# EAGLE schematic miniBCS-4_J005904M (EAGLE 7.7.0)

## Sheet 1 of 2
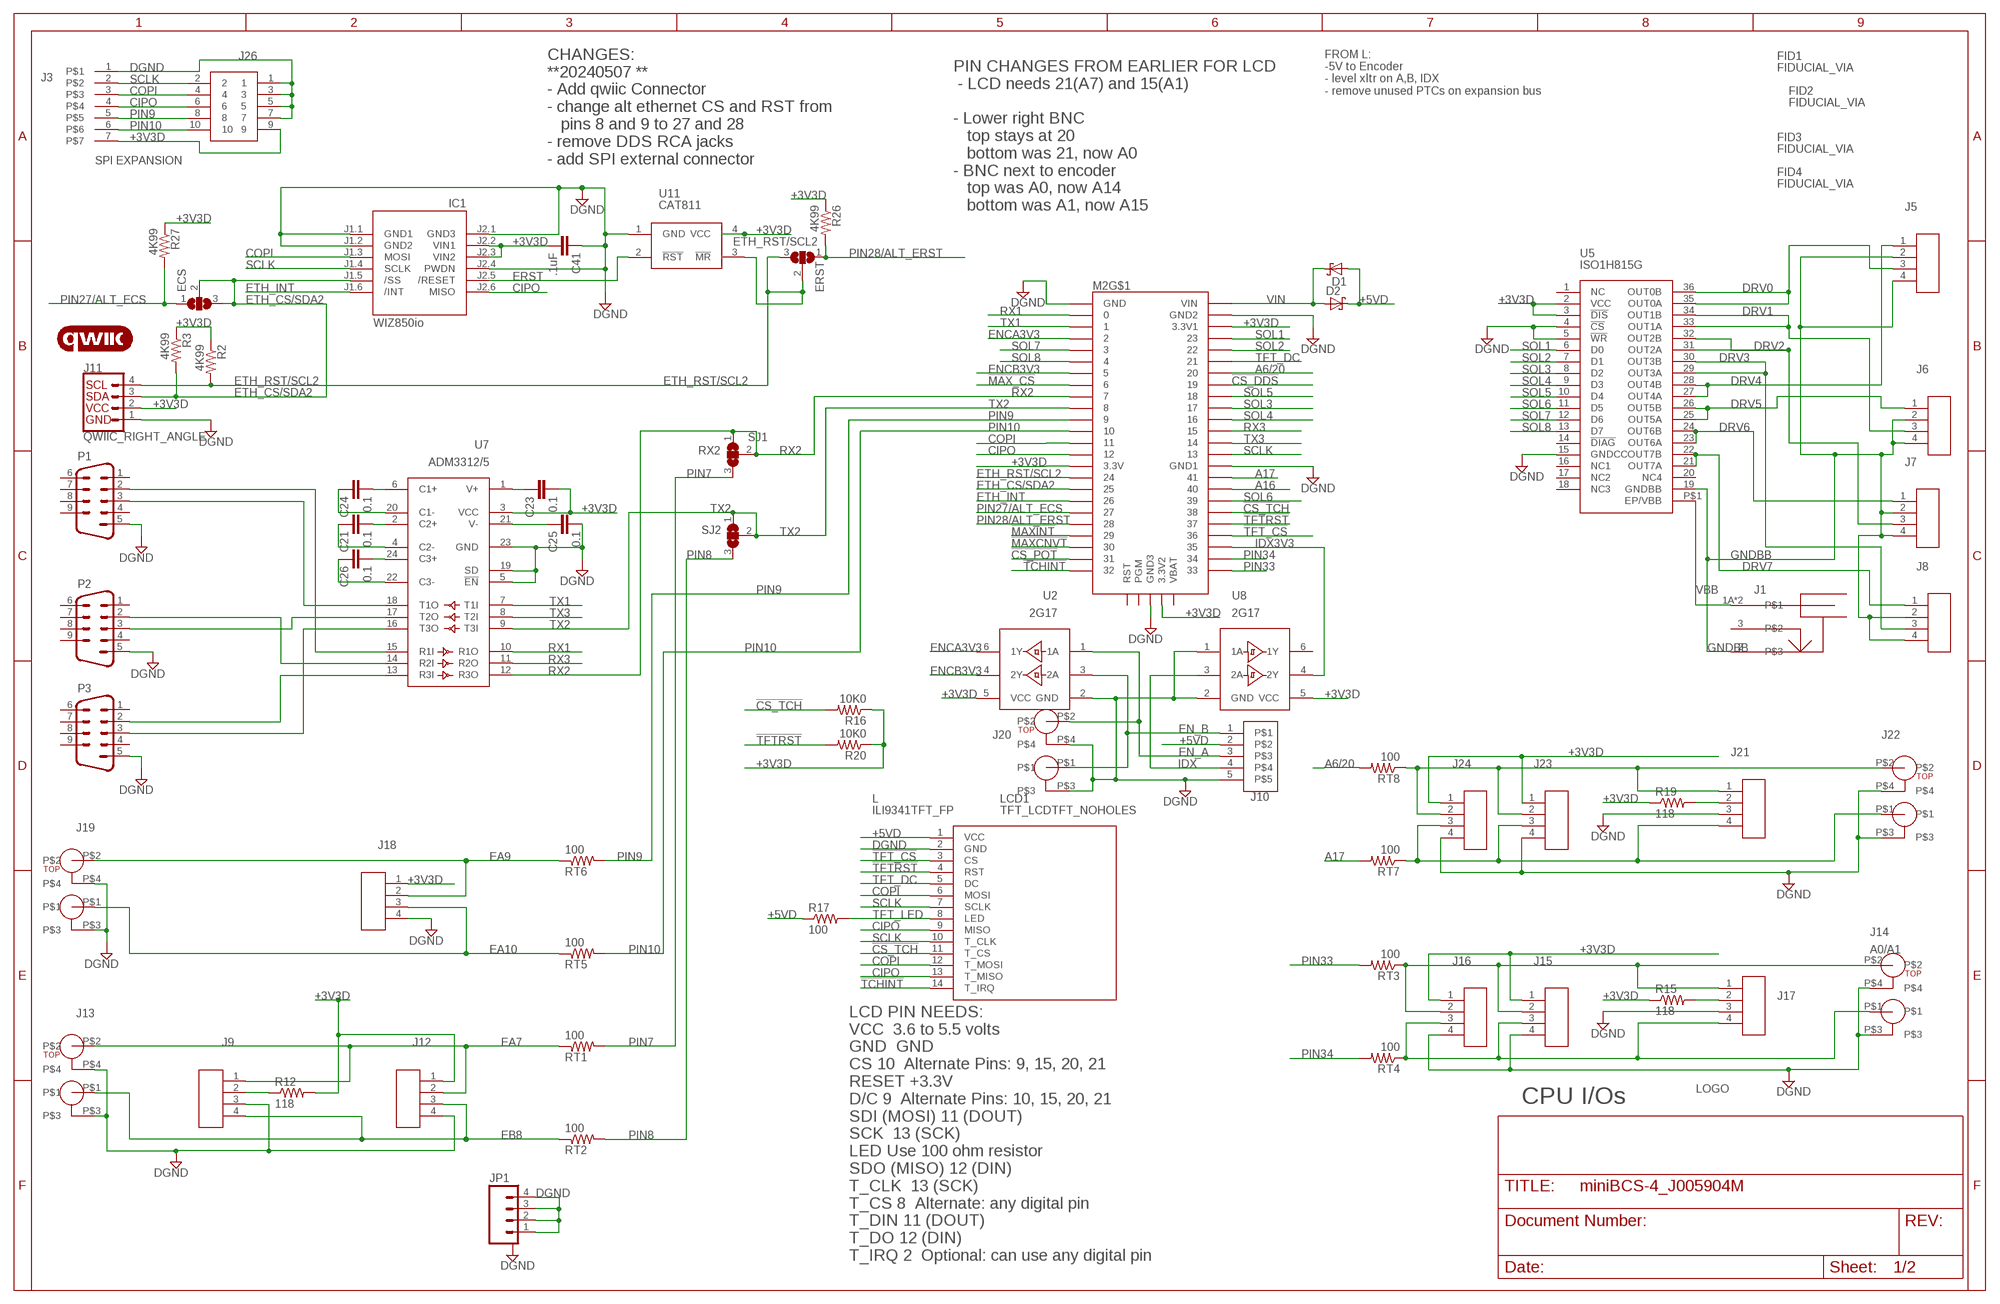
[diagram p0: schematic, sheet 1]

### Parts
C21  0.1  CAPS0603S  [0603S]
C23  0.1  CAPS0603S  [0603S]
C24  0.1  CAPS0603S  [0603S]
C25  0.1  CAPS0603S  [0603S]
C26  0.1  CAPS0603S  [0603S]
C41  .1uF  CAPS0603S  [0603S]
D1  SCHOTTKY-DIODESMD  [SMB]
D2  SCHOTTKY-DIODESMD  [SMB]
ECS  SJ2W  [SJ_2]
ERST  SJ2W  [SJ_2]
FID1  FIDUCIAL_VIA  [FIDUCIAL_VIA]
FID2  FIDUCIAL_VIA  [FIDUCIAL_VIA]
FID3  FIDUCIAL_VIA  [FIDUCIAL_VIA]
FID4  FIDUCIAL_VIA  [FIDUCIAL_VIA]
IC1  WIZ850io  WIZ820IO_DEVICE'DUAL-IN-LINE'  [WIZ820IO]
J1  POWER_JACK_SHUNTPJ-002  [PJ-002]
J3  CON7AMPMODU7-RATH  [AMPMODU7-RATH]
J5  CON41894804  [1894804]
J6  CON41894804  [1894804]
J7  CON41894804  [1894804]
J8  CON41894804  [1894804]
J9  RJ90432024101  [0432024101]
J10  CON5AMPMODU-5  [AMPMODU-5]
J11  QWIIC_RIGHT_ANGLE  QWIIC_CONNECTORJS-1MM  [JST04_1MM_RA]
J12  CON4AMPMODUL-4-RA  [AMPMODU-4-RA]
J13  BNC-DUAL  [DUAL-BNC]
J14  A0/A1  BNC-DUAL  [DUAL-BNC]
J15  CON4AMPMODUL-4-RA  [AMPMODU-4-RA]
J16  CON41881464  [PHOENIX_1881464]
J17  RJ90432024101  [0432024101]
J18  CON4AMPMODUL-4-RA  [AMPMODU-4-RA]
J19  BNC-DUAL  [DUAL-BNC]
J20  BNC-DUAL  [DUAL-BNC]
J21  RJ90432024101  [0432024101]
J22  BNC-DUAL  [DUAL-BNC]
J23  CON4AMPMODUL-4-RA  [AMPMODU-4-RA]
J24  CON41881464  [PHOENIX_1881464]
J26  CON2X52X5-3M-THRA  [2X5SHROUDED-RATH]
JP1  M04LOCK  [1X04_LOCK]
L  ILI9341TFT_FP  [ILI9341TFT_HOLES]
LCD1  TFT_LCDTFT_NOHOLES  [TFT_LCD_NOHOLES]
LOGO1  QWIIC_LOGO_8MM  [QWIIC_8MM]
M2  TEENSY4.1  [TEENSY4.1]
P1  M09-182  [182-009-MALE]
P2  M09-182  [182-009-MALE]
P3  M09-182  [182-009-MALE]
R2  4K99  RESISTOR_SM0805S  [0805S]
R3  4K99  RESISTOR_SM0805S  [0805S]
R12  118  RESISTOR_SM0805S  [0805S]
R15  118  RESISTOR_SM0805S  [0805S]
R16  10K0  RESISTOR_SM0805S  [0805S]
R17  100  RESISTOR_SM0805S  [0805S]
R19  118  RESISTOR_SM0805S  [0805S]
R20  10K0  RESISTOR_SM0805S  [0805S]
R26  4K99  RESISTOR_SM0805S  [0805S]
R27  4K99  RESISTOR_SM0805S  [0805S]
RT1  100  RESISTOR_SM0805S  [0805S]
RT2  100  RESISTOR_SM0805S  [0805S]
RT3  100  RESISTOR_SM0805S  [0805S]
RT4  100  RESISTOR_SM0805S  [0805S]
RT5  100  RESISTOR_SM0805S  [0805S]
RT6  100  RESISTOR_SM0805S  [0805S]
RT7  100  RESISTOR_SM0805S  [0805S]
RT8  100  RESISTOR_SM0805S  [0805S]
SJ1  SJ2W  [SJ_2]
SJ2  SJ2W  [SJ_2]
U2  2G17  [SOT23-6]
U5  ISO1H815G  ISO1H812G  [PG-DSO-36]
U7  ADM3312/5  [TSSOP-24]
U8  2G17  [SOT23-6]
U11  CAT811  [SOT-143]
U$1  JFRC-LOGOLOGO_2014_DOC  [LOGO_JANELIA_2014_DOC]

### Nets
!CS_DDS: M2.19/A5/SCL ; also sheet 2
!CS_POT: M2.31/A12 ; also sheet 2
!CS_TCH: LCD1.11(T_CS) M2.38 R16.2
!MAX_CS: M2.6 ; also sheet 2
!MAXCNVT: M2.30 ; also sheet 2
!MAXINT: M2.29 ; also sheet 2
!TCHINT: LCD1.14(T_IRQ) M2.32
!TFT_CS: LCD1.3(CS) M2.36
!TFTRST: LCD1.4(RST) M2.37 R20.2
+3V3D: C23.2 C41.2 IC1.J2.2(VIN1) IC1.J2.3(VIN2) J3.7 J11.2 J12.1 J15.1 J16.1 J18.1 J23.1 J24.1 J26.9 M2.3V3(3.3V) M2.3V3_LO(3.3V1) M2.V33(3.3V2) R2.1 R3.1 R12.2 R15.1 R16.1 R19.1 R20.1 R26.1 R27.1 U2.5(VCC) U5.2(VCC) U5.3(!DIS) U7.3(VCC) U8.5(VCC) U11.4(VCC) ; also sheet 2
+5VD: D1.A D2.C J10.2 LCD1.1(VCC) R17.1 ; also sheet 2
A6/20: M2.20/A6 RT8.2
A16: M2.40 ; also sheet 2
A17: M2.41 RT7.2
CIPO: IC1.J2.6(MISO) J3.4 J26.6 LCD1.9(MISO) LCD1.13(T_MISO) M2.12/MISO ; also sheet 2
COPI: IC1.J1.3(MOSI) J3.3 J26.4 LCD1.6(MOSI) LCD1.12(T_MOSI) M2.11/MOSI ; also sheet 2
DGND: C25.2 C41.1 IC1.J1.1(GND1) IC1.J1.2(GND2) IC1.J2.1(GND3) IC1.J2.4(PWDN) J3.1 J9.3 J10.5 J11.1 J12.4 J13.P$3 J13.P$4 J14.P$3 J14.P$4 J15.4 J16.4 J17.3 J18.4 J19.P$3 J19.P$4 J20.P$3 J20.P$4 J21.3 J22.P$3 J22.P$4 J23.4 J24.4 J26.1 J26.3 J26.5 J26.7 JP1.1 JP1.2 JP1.3 JP1.4 LCD1.2(GND) M2.AGND(GND2) M2.GND M2.GND1 M2.GND2(GND3) P1.5 P2.5 P3.5 U2.2(GND) U5.4(!CS) U5.5(!WR) U5.15(GNDCC) U7.5(!EN) U7.19(SD) U7.23(GND) U8.1(1A) U8.2(GND) U11.1(GND) ; also sheet 2
DRV0: J5.3 U5.35(OUT0A) U5.36(OUT0B)
DRV1: J6.3 U5.33(OUT1A) U5.34(OUT1B)
DRV2: J7.3 U5.31(OUT2A) U5.32(OUT2B)
DRV3: J8.3 U5.29(OUT3A) U5.30(OUT3B)
DRV4: J5.1 U5.27(OUT4A) U5.28(OUT4B)
DRV5: J6.1 U5.25(OUT5A) U5.26(OUT5B)
DRV6: J7.1 U5.23(OUT6A) U5.24(OUT6B)
DRV7: J8.1 U5.21(OUT7A) U5.22(OUT7B)
EA5: J14.P$2 J15.2 J16.2 J17.1 RT3.1
EA6: J21.1 J22.P$2 J23.2 J24.2 RT8.1
EA7: J9.1 J12.2 J13.P$2 RT1.1
EA9: J18.2 J19.P$2 RT6.1
EA10: J18.3 J19.P$1 RT5.1
EB5: J14.P$1 J15.3 J16.3 J17.4 RT4.1
EB6: J21.4 J22.P$1 J23.3 J24.3 RT7.1
EB8: J9.4 J12.3 J13.P$1 RT2.1
EN_A: J10.3 J20.P$2 U2.1(1A)
EN_B: J10.1 J20.P$1 U2.3(2A)
ENCA3V3: M2.2 U2.6(1Y)
ENCB3V3: M2.5 U2.4(2Y)
ERST: IC1.J2.5(/RESET) U11.2(!RST)
ETH_CS/SDA2: ECS.2 ECS.3 IC1.J1.5(/SS) J11.3 M2.25 R3.2
ETH_INT: IC1.J1.6(/INT) M2.26
ETH_RST/SCL2: ERST.2 ERST.3 J11.4 M2.24 R2.2 U11.3(!MR)
GNDBB: J1.2 J5.2 J5.4 J6.2 J6.4 J7.2 J7.4 J8.2 J8.4 U5.19(GNDBB)
IDX: J10.4 U8.3(2A)
IDX3V3: M2.35 U8.4(2Y)
N$3: J9.2 R12.1
N$4: J21.2 R19.2
N$8: J17.2 R15.2
N$9: P2.2 U7.14(R2I)
N$11: P2.3 U7.17(T2O)
N$12: C23.1 U7.1(V+)
N$15: C25.1 U7.21(V-)
N$16: P1.3 U7.18(T1O)
N$21: C26.2 U7.24(C3+)
N$23: C26.1 U7.22(C3-)
N$25: C21.1 U7.4(C2-)
N$26: C21.2 U7.2(C2+)
N$27: C24.1 U7.20(C1-)
N$28: P1.2 U7.15(R1I)
N$31: C24.2 U7.6(C1+)
N$44: P3.3 U7.16(T3O)
PIN7: RT1.2 SJ1.3
PIN8: RT2.2 SJ2.3
PIN9: J3.5 J26.8 M2.9 RT6.2
PIN10: J3.6 J26.10 M2.10/CS RT5.2
PIN27/ALT_ECS: ECS.1 M2.27 R27.2 ; also sheet 2
PIN28/ALT_ERST: ERST.1 M2.28 R26.2 ; also sheet 2
PIN33: M2.33 RT3.2
PIN34: M2.34 RT4.2
RX1: M2.0/RX U7.10(R1O)
RX2: M2.7 SJ1.1 SJ1.2 U7.12(R3O)
RX3: M2.15/A1 U7.11(R2O)
RX3_232: P3.2 U7.13(R3I)
SCLK: IC1.J1.4(SCLK) J3.2 J26.2 LCD1.7(SCLK) LCD1.10(T_CLK) M2.13/SCK ; also sheet 2
SOL1: M2.23/A9 U5.6(D0)
SOL2: M2.22/A8 U5.7(D1)
SOL3: M2.17/A3 U5.8(D2)
SOL4: M2.16/A2 U5.9(D3)
SOL5: M2.18/A4/SDA U5.10(D4)
SOL6: M2.39 U5.11(D5)
SOL7: M2.3 U5.12(D6)
SOL8: M2.4 U5.13(D7)
TFT_DC: LCD1.5(DC) M2.21/A7
TFT_LED: LCD1.8(LED) R17.2
TX1: M2.1/TX U7.7(T1I)
TX2: M2.8 SJ2.1 SJ2.2 U7.9(T3I)
TX3: M2.14/A0 U7.8(T2I)
VBB: J1.1A J1.1B U5.P$1(EP/VBB)
VIN: D1.C D2.A M2.VIN
Unconnected: J1.3 M2.ELED M2.ER+ M2.ER- M2.ET+(ET-) M2.ET-(ET+) M2.GND-E(EGND) M2.GND-U1(UGND1) M2.GND-U2(UGND2) M2.PROG(PGM) M2.RST M2.UD+(UDP) M2.UD-(UDM) M2.UVHST(U5V) M2.VBAT P1.1 P1.4 P1.6 P1.7 P1.8 P1.9 P2.1 P2.4 P2.6 P2.7 P2.8 P2.9 P3.1 P3.4 P3.6 P3.7 P3.8 P3.9 U5.1(NC) U5.14(!DIAG) U5.16(NC1) U5.17(NC2) U5.18(NC3) U5.20(NC4) U8.6(1Y)

### Notes on the sheet
- FROM L:
  -5V to Encoder
  - level xltr on A,B, IDX
  - remove unused PTCs on expansion bus
- SPI EXPANSION
- CHANGES:
  **20240507 **
  - Add qwiic Connector
  - change alt ethernet CS and RST from
     pins 8 and 9 to 27 and 28
  - remove DDS RCA jacks
  - add SPI external connector
- PIN CHANGES FROM EARLIER FOR LCD
   - LCD needs 21(A7) and 15(A1)
  
  - Lower right BNC
     top stays at 20
     bottom was 21, now A0
  - BNC next to encoder 
     top was A0, now A14
     bottom was A1, now A15
- CPU I/Os
- LCD PIN NEEDS:
  VCC  3.6 to 5.5 volts
  GND  GND
  CS 10  Alternate Pins: 9, 15, 20, 21
  RESET +3.3V
  D/C 9  Alternate Pins: 10, 15, 20, 21
  SDI (MOSI) 11 (DOUT)
  SCK  13 (SCK)
  LED Use 100 ohm resistor
  SDO (MISO) 12 (DIN)
  T_CLK  13 (SCK)
  T_CS 8  Alternate: any digital pin
  T_DIN 11 (DOUT)
  T_DO 12 (DIN)
  T_IRQ 2  Optional: can use any digital pin

## Sheet 2 of 2
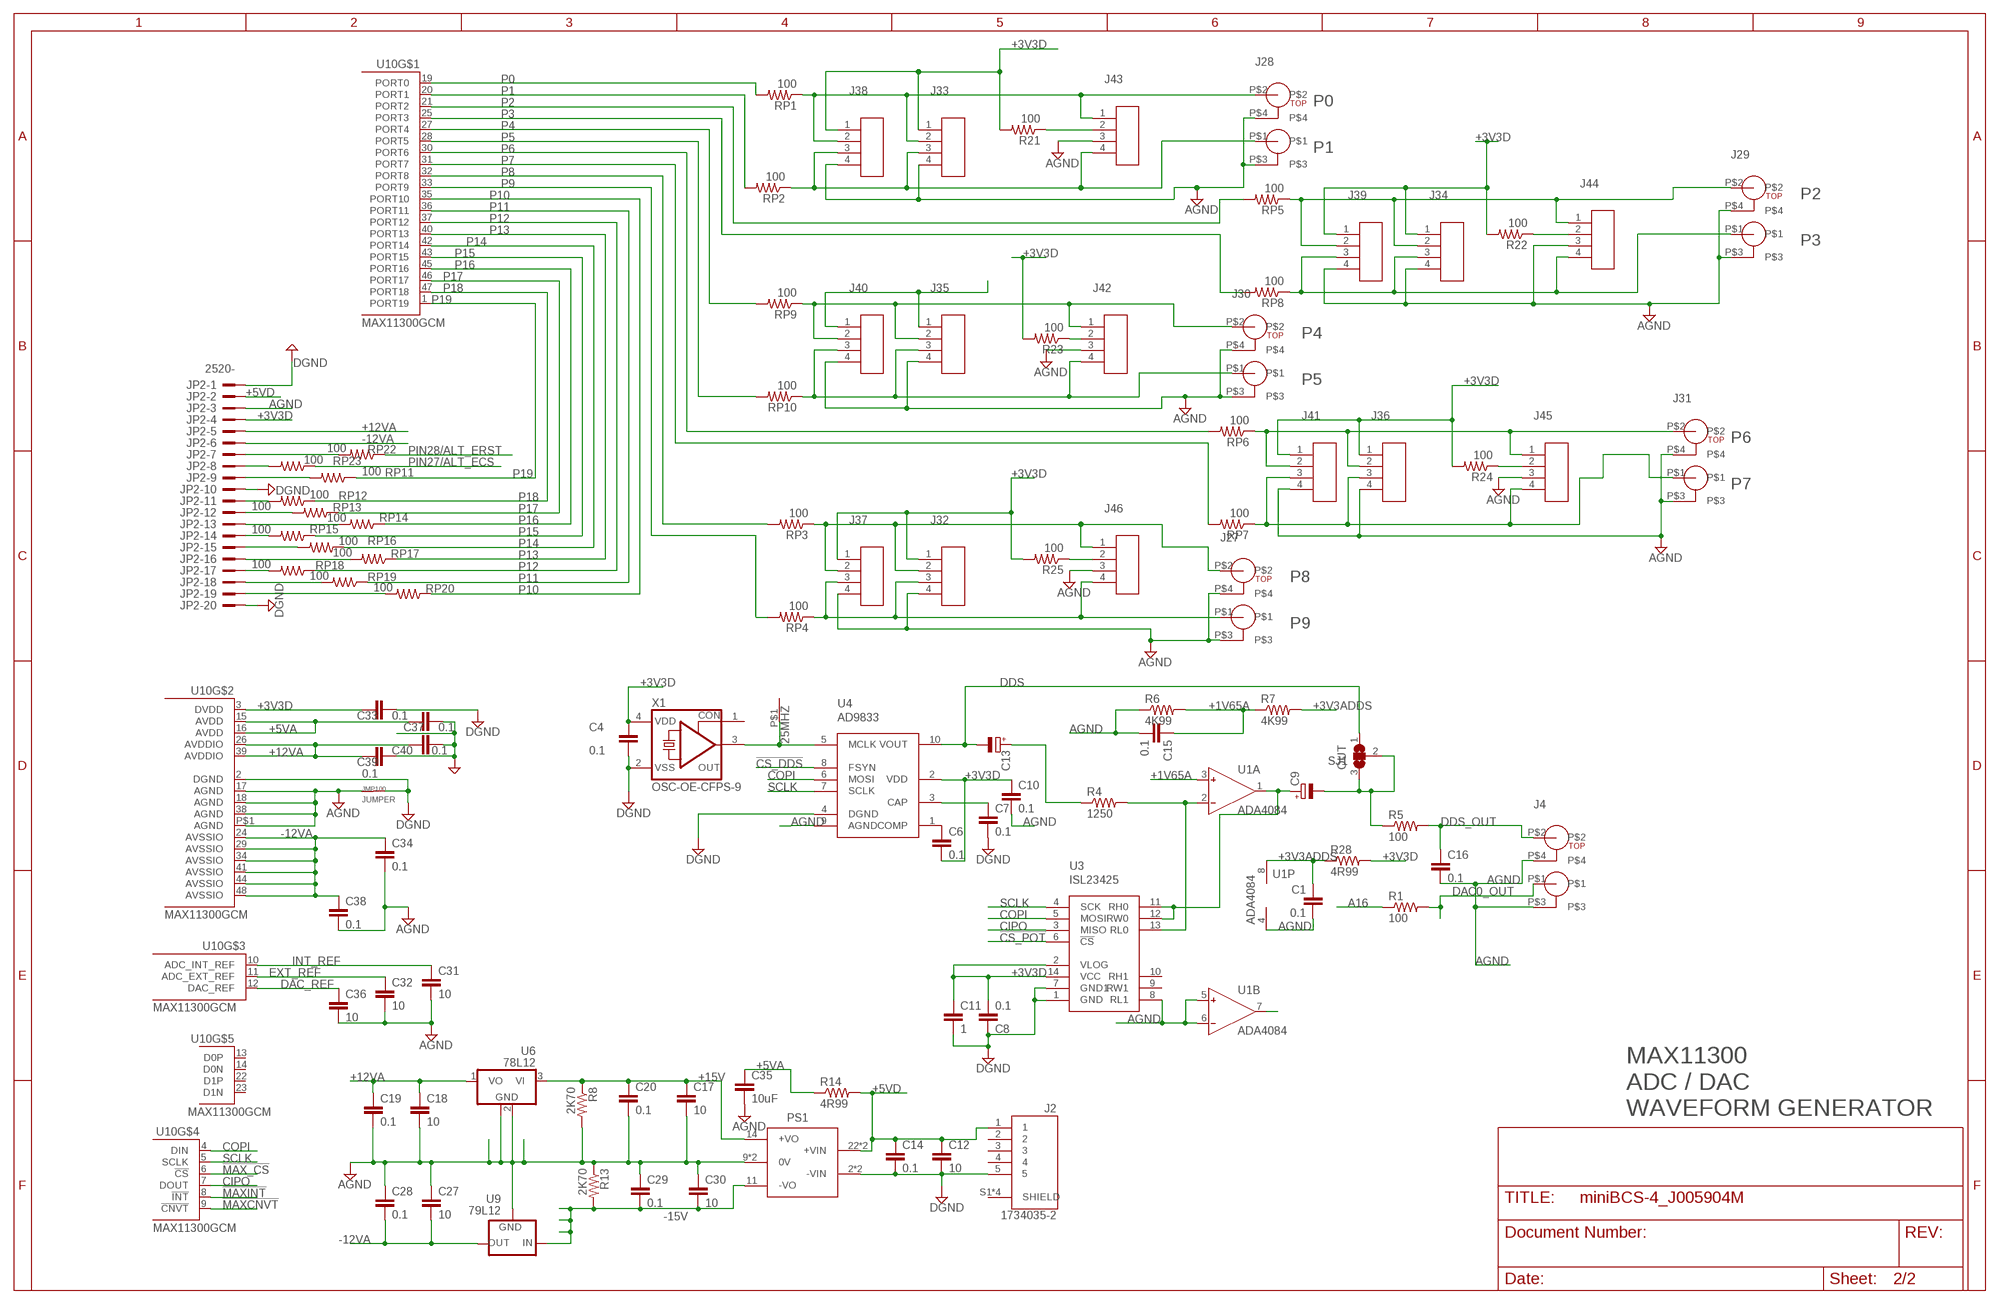
[diagram p1: schematic, sheet 2]

### Parts
25MHZ  CON1  [PAD032]
C1  0.1  CAPS0603S  [0603S]
C4  0.1  CAPS0603S  [0603S]
C6  0.1  CAPS0603S  [0603S]
C7  0.1  CAPS0603S  [0603S]
C8  0.1  CAPS0603S  [0603S]
C9  CPOL-EUC  [PANASONIC_C]
C10  0.1  CAPS0603S  [0603S]
C11  1  CAPS0805S  [0805S]
C12  10  CAPS1206S  [1206S]
C13  CPOL-EUC  [PANASONIC_C]
C14  0.1  CAPS0603S  [0603S]
C15  0.1  CAPS0603S  [0603S]
C16  0.1  CAPS0805S  [0805S]
C17  10  CAPS1206S  [1206S]
C18  10  CAPS1206S  [1206S]
C19  0.1  CAPS0603S  [0603S]
C20  0.1  CAPS0603S  [0603S]
C27  10  CAPS1206S  [1206S]
C28  0.1  CAPS0603S  [0603S]
C29  0.1  CAPS0603S  [0603S]
C30  10  CAPS1206S  [1206S]
C31  10  CAPS1206S  [1206S]
C32  10  CAPS1206S  [1206S]
C33  0.1  CAPS0603S  [0603S]
C34  0.1  CAPS0603S  [0603S]
C35  10uF  CAPS1206S  [1206S]
C36  10  CAPS1206S  [1206S]
C37  0.1  CAPS0603S  [0603S]
C38  0.1  CAPS0603S  [0603S]
C39  0.1  CAPS0603S  [0603S]
C40  0.1  CAPS0603S  [0603S]
J2  1734035-2  [CONN_1734035-2]
J4  BNC-DUAL  [DUAL-BNC]
J27  BNC-DUAL  [DUAL-BNC]
J28  BNC-DUAL  [DUAL-BNC]
J29  BNC-DUAL  [DUAL-BNC]
J30  BNC-DUAL  [DUAL-BNC]
J31  BNC-DUAL  [DUAL-BNC]
J32  CON4AMPMODUL-4-RA  [AMPMODU-4-RA]
J33  CON4AMPMODUL-4-RA  [AMPMODU-4-RA]
J34  CON4AMPMODUL-4-RA  [AMPMODU-4-RA]
J35  CON4AMPMODUL-4-RA  [AMPMODU-4-RA]
J36  CON4AMPMODUL-4-RA  [AMPMODU-4-RA]
J37  CON41881464  [PHOENIX_1881464]
J38  CON41881464  [PHOENIX_1881464]
J39  CON41881464  [PHOENIX_1881464]
J40  CON41881464  [PHOENIX_1881464]
J41  CON41881464  [PHOENIX_1881464]
J42  RJ90432024101  [0432024101]
J43  RJ90432024101  [0432024101]
J44  RJ90432024101  [0432024101]
J45  RJ90432024101  [0432024101]
J46  RJ90432024101  [0432024101]
JMP100  JUMPER  [JUMPER]
JP2  2520-  [PAK100/2500-20]
OUT  SJ1  SJ2W  [SJ_2]
PS1  DC-DC_NTANDTD  [NDTD]
R1  100  RESISTOR_SM0805S  [0805S]
R4  1250  RESISTOR_SM0805S  [0805S]
R5  100  RESISTOR_SM0805S  [0805S]
R6  4K99  RESISTOR_SM0805S  [0805S]
R7  4K99  RESISTOR_SM0805S  [0805S]
R8  2K70  RESISTOR_SM0805S  [0805S]
R13  2K70  RESISTOR_SM0805S  [0805S]
R14  4R99  RESISTOR_SM0805S  [0805S]
R21  100  RESISTOR_SM0805S  [0805S]
R22  100  RESISTOR_SM0805S  [0805S]
R23  100  RESISTOR_SM0805S  [0805S]
R24  100  RESISTOR_SM0805S  [0805S]
R25  100  RESISTOR_SM0805S  [0805S]
R28  4R99  RESISTOR_SM0805S  [0805S]
RP1  100  RESISTOR_SM0805S  [0805S]
RP2  100  RESISTOR_SM0805S  [0805S]
RP3  100  RESISTOR_SM0805S  [0805S]
RP4  100  RESISTOR_SM0805S  [0805S]
RP5  100  RESISTOR_SM0805S  [0805S]
RP6  100  RESISTOR_SM0805S  [0805S]
RP7  100  RESISTOR_SM0805S  [0805S]
RP8  100  RESISTOR_SM0805S  [0805S]
RP9  100  RESISTOR_SM0805S  [0805S]
RP10  100  RESISTOR_SM0805S  [0805S]
RP11  100  RESISTOR_SM0805S  [0805S]
RP12  100  RESISTOR_SM0805S  [0805S]
RP13  100  RESISTOR_SM0805S  [0805S]
RP14  100  RESISTOR_SM0805S  [0805S]
RP15  100  RESISTOR_SM0805S  [0805S]
RP16  100  RESISTOR_SM0805S  [0805S]
RP17  100  RESISTOR_SM0805S  [0805S]
RP18  100  RESISTOR_SM0805S  [0805S]
RP19  100  RESISTOR_SM0805S  [0805S]
RP20  100  RESISTOR_SM0805S  [0805S]
RP22  100  RESISTOR_SM0805S  [0805S]
RP23  100  RESISTOR_SM0805S  [0805S]
U1  ADA4084  AD712R  [SO8]
U3  ISL23425  [TSSOP14]
U4  AD9833  [MSOP10]
U6  78L12  78L15F  [SOT89]
U9  79L12  79LXXSOT89  [SOT89]
U10  MAX11300GCM  [TQFP48]
X1  OSC-OE-CFPS-9  [5.2X3.4-4-PAD]

### Nets
!CS_DDS: U4.8(FSYN) ; also sheet 1
!CS_POT: U3.6(!CS) ; also sheet 1
!MAX_CS: U10.6(!CS!) ; also sheet 1
!MAXCNVT: U10.9(!CNVT!) ; also sheet 1
!MAXINT: U10.8(!INT!) ; also sheet 1
+1V65A: C15.1 R6.2 R7.1 U1.3(A:IN+)
+3V3ADDS: C1.1 R7.2 R28.1 U1.8(P:V+)
+3V3D: C4.1 C6.2 C8.2 C10.1 C11.1 C33.1 J32.1 J33.1 J34.1 J36.1 J37.1 J38.1 J39.1 J41.1 JP2.4 R21.2 R22.2 R23.2 R24.2 R25.2 R28.2 U3.2(VLOG) U3.14(VCC) U4.2(VDD) U10.3(DVDD) X1.4(VDD) ; also sheet 1
+5VA: C35.1 C37.1 R14.1 U10.15(AVDD) U10.16(AVDD)
+5VD: C12.1 C14.1 J2.1 JP2.2 PS1.22(+VIN) PS1.23(+VIN) R14.2 ; also sheet 1
+12VA: C18.1 C19.1 C39.1 C40.1 JP2.5 U6.1(VO) U10.26(AVDDIO) U10.39(AVDDIO)
+15V: C17.1 C20.1 PS1.14(+VO) R8.1 U6.3(VI)
-12VA: C27.2 C28.2 C34.1 C38.1 JP2.6 U9.3(OUT) U10.24(AVSSIO) U10.29(AVSSIO) U10.34(AVSSIO) U10.41(AVSSIO) U10.44(AVSSIO) U10.48(AVSSIO)
-15V: C29.2 C30.2 PS1.11(-VO) R13.2 U9.2(IN) U9.2@1(IN)
A16: R1.1 ; also sheet 1
AGND: C1.2 C10.2 C15.2 C16.2 C17.2 C18.2 C19.2 C20.2 C27.1 C28.1 C29.1 C30.1 C31.2 C32.2 C34.2 C35.2 C36.2 C37.2 C38.2 C39.2 C40.2 J4.P$3 J4.P$4 J27.P$3 J27.P$4 J28.P$3 J28.P$4 J29.P$3 J29.P$4 J30.P$3 J30.P$4 J31.P$3 J31.P$4 J32.4 J33.4 J34.4 J35.4 J36.4 J37.4 J38.4 J39.4 J40.4 J41.4 J42.3 J43.3 J44.3 J45.3 J46.3 JMP100.1 JP2.3 PS1.9(0V) PS1.16(0V) R6.1 R8.2 R13.1 U1.4(P:V-) U1.5(B:IN+) U1.6(B:IN-) U3.8(RL1) U4.9(AGND) U6.2(GND) U6.2@1(GND) U9.1(GND) U10.17(AGND) U10.18(AGND) U10.38(AGND) U10.P$1(AGND)
CIPO: U3.3(MISO) U10.7(DOUT) ; also sheet 1
COPI: U3.5(MOSI) U4.6(MOSI) U10.4(DIN) ; also sheet 1
DAC0_OUT: J4.P$1 R1.2
DAC_REF: C36.1 U10.12(DAC_REF)
DDS: C13.- OUT.1 U4.10(VOUT)
DDS_OUT: C16.1 J4.P$2 R5.2
DGND: C4.2 C7.2 C8.1 C11.2 C12.2 C14.2 C33.2 J2.5 JMP100.2 JP2.1 JP2.10 JP2.20 PS1.2(-VIN) PS1.3(-VIN) U3.1(GND) U3.7(GND1) U4.4(DGND) U10.2(DGND) X1.2(VSS) ; also sheet 1
EA: J28.P$2 J33.2 J38.2 J43.1 RP1.1
EA1: J29.P$2 J34.2 J39.2 J44.1 RP5.1
EA2: J30.P$2 J35.2 J40.2 J42.1 RP9.1
EA3: J31.P$2 J36.2 J41.2 J45.1 RP6.1
EA4: J27.P$2 J32.2 J37.2 J46.1 RP3.1
EB: J28.P$1 J33.3 J38.3 J43.4 RP2.1
EB1: J29.P$1 J34.3 J39.3 J44.4 RP8.1
EB2: J30.P$1 J35.3 J40.3 J42.4 RP10.1
EB3: J31.P$1 J36.3 J41.3 J45.4 RP7.1
EB4: J27.P$1 J32.3 J37.3 J46.4 RP4.1
EXT_REF: C32.1 U10.11(ADC_EXT_REF)
INT_REF: C31.1 U10.10(ADC_INT_REF)
N$1: JP2.8 RP23.2
N$13: 25MHZ.P$1 U4.5(MCLK) X1.3(OUT)
N$20: C7.1 U4.3(CAP)
N$22: C6.1 U4.1(COMP)
N$24: J43.2 R21.1
N$29: J42.2 R23.1
N$33: J46.2 R25.1
N$34: C13.+ R4.1
N$35: J45.2 R24.1
N$36: R4.2 U1.2(A:IN-) U3.13(RL0)
N$37: U1.7(B:OUT)
N$38: C9.+ U1.1(A:OUT) U3.11(RH0) U3.12(RW0)
N$41: J44.2 R22.1
N$42: JP2.14 RP15.2
N$51: JP2.13 RP14.2
N$53: JP2.19 RP20.2
N$54: JP2.18 RP19.2
N$55: JP2.17 RP18.2
N$56: JP2.16 RP17.2
N$57: JP2.15 RP16.2
N$58: JP2.12 RP13.2
N$59: JP2.11 RP12.2
N$60: JP2.9 RP11.2
N$62: JP2.7 RP22.2
P0: RP1.2 U10.19(PORT0)
P1: RP2.2 U10.20(PORT1)
P2: RP5.2 U10.21(PORT2)
P3: RP8.2 U10.25(PORT3)
P4: RP9.2 U10.27(PORT4)
P5: RP10.2 U10.28(PORT5)
P6: RP6.2 U10.30(PORT6)
P7: RP7.2 U10.31(PORT7)
P8: RP3.2 U10.32(PORT8)
P9: RP4.2 U10.33(PORT9)
P10: RP20.1 U10.35(PORT10)
P11: RP19.1 U10.36(PORT11)
P12: RP18.1 U10.37(PORT12)
P13: RP17.1 U10.40(PORT13)
P14: RP16.1 U10.42(PORT14)
P15: RP15.1 U10.43(PORT15)
P16: RP14.1 U10.45(PORT16)
P17: RP13.1 U10.46(PORT17)
P18: RP12.1 U10.47(PORT18)
P19: RP11.1 U10.1(PORT19)
PIN27/ALT_ECS: RP23.1 ; also sheet 1
PIN28/ALT_ERST: RP22.1 ; also sheet 1
PWR_P4-5: J35.1 J40.1
SCLK: U3.4(SCK) U4.7(SCLK) U10.5(SCLK) ; also sheet 1
SJ1: C9.- OUT.2 OUT.3 R5.1
Unconnected: J2.2 J2.3 J2.4 J2.S1(SHIELD) J2.S2(SHIELD) J2.S3(SHIELD) J2.S4(SHIELD) U3.9(RW1) U3.10(RH1) U10.13(D0P) U10.14(D0N) U10.22(D1P) U10.23(D1N) X1.1(CON)

### Notes on the sheet
- P0
- P1
- P2
- P3
- P4
- P5
- P6
- P7
- P8
- P9
- MAX11300 
  ADC / DAC 
  WAVEFORM GENERATOR

## Library data of the parts
25MHZ = STEVES_BU:CON1
C1 C4 C6-C8 C10 C11 C15 C21 C23-C26 = STEVES_BU:CAPS
C9 C13 = rcl:CPOL-EU: POLARIZED CAPACITOR, European symbol
C12 C14 C16-C20 C27-C41 = SteveS:CAPS
D1 D2 = diode:SCHOTTKY-DIODE: Schottky Diode
ECS ERST OUT SJ1 SJ2 = jumper:SJ2W: SMD solder JUMPER
FID1-FID4 = STEVES_BU:FIDUCIAL_VIA
IC1 = Wiz820io:WIZ820IO_DEVICE: WIZnet, WIZ820io plug in module incl. W5200 chip and MagJack
J1 = STEVES_BU:POWER_JACK_SHUNT
J2 = 1734035-2:1734035-2: CONN MINI USB RCPT RA TYPE B SMD; MANUFACTURER: TE Connectivity; PARTREV: F; STANDARD: Manufacturer recommendations
J3 = STEVES_BU:CON7
J4 J13 J14 J19 J20 J22 J27-J31 = STEVES_BU:BNC-DUAL: Dual isolated BNC
J5-J8 J12 J15 J16 J18 J23 J24 J32-J41 = STEVES_BU:CON4
J9 J17 J21 J42-J46 = STEVES_BU:RJ9
J10 = STEVES_BU:CON5
J11 = SparkFun-Connectors:QWIIC_CONNECTOR: SparkFun I2C Standard Qwiic Connector An SMD 1mm pitch JST connector makes it easy and quick (get it? Qwiic?) to connect I2C devices to each other. The Qwiic system <http://www.sparkfun.com/qwiic> enables fast and solderless connection between popular platforms and various sensors and actuators. We carry 200mm <https://www.sparkfun.com/products/14204>, 100mm <https://www.sparkfun.com/products/14205>, 50mm <https://www.sparkfun.com/products/14206>, and breadboard friendly <https://www.sparkfun.com/products/14207> Qwiic cables. We also offer 10 pcs strips <https://www.sparkfun.com/products/14323> the SMD connectors.; PROD_ID: CONN-13694
J26 = STEVES_BU:CON2X5
JMP100 = STEVES_BU:JUMPER
JP1 = SparkFun:M04: Header 4 Standard 4-pin 0.1" header. Use with straight break away headers (SKU : PRT-00116), right angle break away headers (PRT-00553), swiss pins (PRT-00743), machine pins (PRT-00117), and female headers (PRT-00115). Molex polarized connector foot print use with SKU : PRT-08231 with associated crimp pins and housings.
JP2 = con-3m:2520-: 3M (TM) Pak 100 4-Wall Header Source: 3M; OC_FARNELL: unknown; OC_NEWARK: unknown
L = STEVES_BU:ILI9341TFT_FP
LCD1 = STEVES_BU:TFT_LCD
LOGO1 = SparkFun-Aesthetics:QWIIC_LOGO: Qwiic Logos for placement on schematic and PCB. The 5.5mm silk logo is best for placing next to Qwiic connector.
M2 = teensy4.1.dist:TEENSY4.1
P1-P3 = con-subd:M09: SUB-D; OC_FARNELL: unknown; OC_NEWARK: unknown
PS1 = STEVES_BU:DC-DC_NTA
R1-R3 R5 R8 R12-R17 R19-R28 RP1-RP20 RP22 RP23 RT1-RT8 = SteveS:RESISTOR_SM
R4 R6 R7 = STEVES_BU:RESISTOR_SM
U1 = analog-devices:AD712: Dual Precision, Low Cost, High Speed BiFET Op Amp Source: http://www.analog.com/static/imported-files/data_sheets/AD712.pdf; MF: ALTERA CORPORATION; MPN: AD712KRZ; OC_FARNELL: 1263975; OC_NEWARK: 59K4556
U2 U8 = STEVES_BU:2G17
U3 = STEVES_BU:ISL23425
U4 = STEVES_BU:AD9833
U5 = STEVES_BU:ISO1H812G
U6 = linear:78L*: POSITOIV-VOLTAGE REGULATORS Output up to 100 mA Source: Datasheet <http://focus.ti.com/lit/ds/symlink/ua78l05.pdf>
U7 = STEVES_BU:ADM3312/5
U9 = jfrc:79LXX: VOLTAGE REGULATOR
U10 = MAX11300:MAX11300GCM
U11 = STEVES_BU:CAT811
U$1 = STEVES_BU:JFRC-LOGO
X1 = IQD-Frequency-Products:OSC-OE: OSCILLATOR WITH OE

## Net classes
1 power: width 0.254 mm